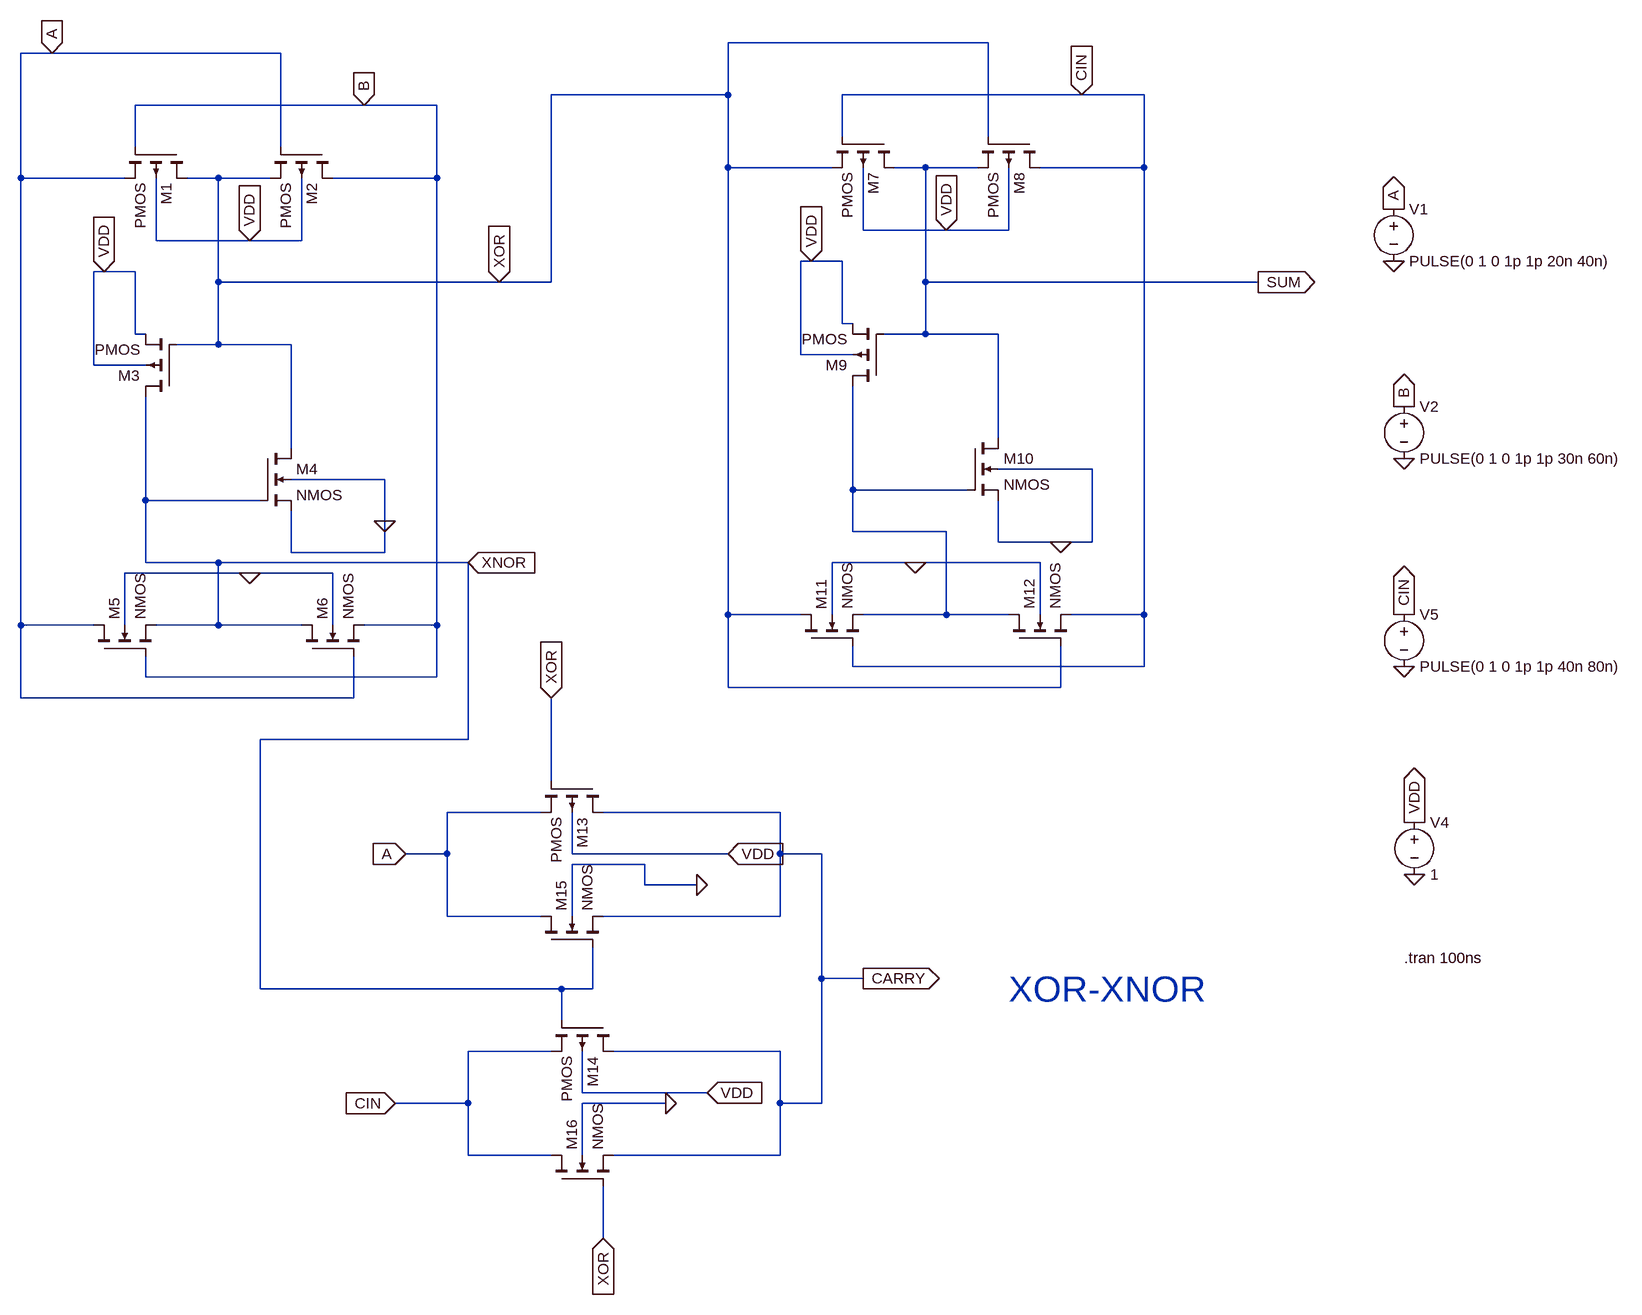
[diagram p0: schematic XOR-XNOR.asc]
XOR-XNOR.asc, the LTspice schematic file:
Version 4
SHEET 1 3128 1804
WIRE 1520 -128 1120 -128
WIRE 80 -112 32 -112
WIRE 432 -112 80 -112
WIRE 1120 -48 1120 -128
WIRE 1120 -48 848 -48
WIRE 1664 -48 1296 -48
WIRE 1760 -48 1664 -48
WIRE 560 -32 208 -32
WIRE 672 -32 560 -32
WIRE 1296 16 1296 -48
WIRE 1520 16 1520 -128
WIRE 208 32 208 -32
WIRE 432 32 432 -112
WIRE 1120 64 1120 -48
WIRE 1280 64 1120 64
WIRE 1424 64 1376 64
WIRE 1504 64 1424 64
WIRE 1760 64 1760 -48
WIRE 1760 64 1600 64
WIRE 32 80 32 -112
WIRE 192 80 32 80
WIRE 336 80 288 80
WIRE 416 80 336 80
WIRE 672 80 672 -32
WIRE 672 80 512 80
WIRE 1328 160 1328 64
WIRE 1456 160 1328 160
WIRE 1552 160 1552 64
WIRE 1552 160 1456 160
WIRE 240 176 240 80
WIRE 384 176 240 176
WIRE 464 176 464 80
WIRE 464 176 384 176
WIRE 1248 208 1232 208
WIRE 1296 208 1248 208
WIRE 160 224 144 224
WIRE 208 224 160 224
WIRE 336 240 336 80
WIRE 768 240 336 240
WIRE 848 240 848 -48
WIRE 848 240 768 240
WIRE 1424 240 1424 64
WIRE 1936 240 1424 240
WIRE 1296 304 1296 208
WIRE 1312 304 1296 304
WIRE 208 320 208 224
WIRE 224 320 208 320
WIRE 1424 320 1424 240
WIRE 1424 320 1360 320
WIRE 1536 320 1424 320
WIRE 336 336 336 240
WIRE 336 336 272 336
WIRE 448 336 336 336
WIRE 1232 352 1232 208
WIRE 1312 352 1232 352
WIRE 144 368 144 224
WIRE 224 368 144 368
WIRE 1536 480 1536 320
WIRE 448 496 448 336
WIRE 1680 528 1536 528
WIRE 592 544 448 544
WIRE 1312 560 1312 400
WIRE 1488 560 1312 560
WIRE 224 576 224 416
WIRE 400 576 224 576
WIRE 592 608 592 544
WIRE 1312 624 1312 560
WIRE 1456 624 1312 624
WIRE 1536 640 1536 576
WIRE 1632 640 1536 640
WIRE 1680 640 1680 528
WIRE 1680 640 1632 640
WIRE 448 656 448 592
WIRE 592 656 592 608
WIRE 592 656 448 656
WIRE 224 672 224 576
WIRE 336 672 224 672
WIRE 720 672 336 672
WIRE 1408 672 1280 672
WIRE 1600 672 1408 672
WIRE 384 688 192 688
WIRE 512 688 384 688
WIRE 1120 752 1120 64
WIRE 1232 752 1120 752
WIRE 1280 752 1280 672
WIRE 1456 752 1456 624
WIRE 1456 752 1328 752
WIRE 1552 752 1456 752
WIRE 1600 752 1600 672
WIRE 1760 752 1760 64
WIRE 1760 752 1648 752
WIRE 32 768 32 80
WIRE 144 768 32 768
WIRE 192 768 192 688
WIRE 336 768 336 672
WIRE 336 768 240 768
WIRE 464 768 336 768
WIRE 512 768 512 688
WIRE 672 768 672 80
WIRE 672 768 560 768
WIRE 1312 832 1312 800
WIRE 1760 832 1760 752
WIRE 1760 832 1312 832
WIRE 224 848 224 816
WIRE 672 848 672 768
WIRE 672 848 224 848
WIRE 1120 864 1120 752
WIRE 1632 864 1632 800
WIRE 1632 864 1120 864
WIRE 32 880 32 768
WIRE 544 880 544 816
WIRE 544 880 32 880
WIRE 720 944 720 672
WIRE 720 944 400 944
WIRE 848 1008 848 880
WIRE 832 1056 688 1056
WIRE 1200 1056 928 1056
WIRE 688 1120 688 1056
WIRE 688 1120 624 1120
WIRE 880 1120 880 1056
WIRE 1120 1120 880 1120
WIRE 1200 1120 1200 1056
WIRE 1264 1120 1200 1120
WIRE 992 1136 880 1136
WIRE 992 1168 992 1136
WIRE 1072 1168 992 1168
WIRE 688 1216 688 1120
WIRE 832 1216 688 1216
WIRE 880 1216 880 1136
WIRE 1200 1216 1200 1120
WIRE 1200 1216 928 1216
WIRE 1264 1312 1264 1120
WIRE 1328 1312 1264 1312
WIRE 400 1328 400 944
WIRE 864 1328 400 1328
WIRE 912 1328 912 1264
WIRE 912 1328 864 1328
WIRE 864 1376 864 1328
WIRE 848 1424 720 1424
WIRE 1200 1424 944 1424
WIRE 896 1488 896 1424
WIRE 1088 1488 896 1488
WIRE 720 1504 720 1424
WIRE 720 1504 608 1504
WIRE 1024 1504 896 1504
WIRE 1200 1504 1200 1424
WIRE 1264 1504 1264 1312
WIRE 1264 1504 1200 1504
WIRE 720 1584 720 1504
WIRE 848 1584 720 1584
WIRE 896 1584 896 1504
WIRE 1200 1584 1200 1504
WIRE 1200 1584 944 1584
WIRE 928 1712 928 1632
FLAG 560 -32 B
IOPIN 560 -32 In
FLAG 384 176 VDD
IOPIN 384 176 In
FLAG 160 224 VDD
IOPIN 160 224 In
FLAG 592 608 0
FLAG 384 688 0
FLAG 848 880 XOR
IOPIN 848 880 In
FLAG 720 672 XNOR
IOPIN 720 672 In
FLAG 624 1120 A
IOPIN 624 1120 In
FLAG 1072 1168 0
FLAG 1120 1120 VDD
IOPIN 1120 1120 In
FLAG 1088 1488 VDD
IOPIN 1088 1488 In
FLAG 1024 1504 0
FLAG 928 1712 XOR
IOPIN 928 1712 In
FLAG 1328 1312 CARRY
IOPIN 1328 1312 Out
FLAG 1664 -48 CIN
IOPIN 1664 -48 In
FLAG 1456 160 VDD
IOPIN 1456 160 In
FLAG 1936 240 SUM
IOPIN 1936 240 Out
FLAG 1248 208 VDD
IOPIN 1248 208 In
FLAG 1632 640 0
FLAG 1408 672 0
FLAG 2144 128 A
IOPIN 2144 128 Out
FLAG 2144 208 0
FLAG 2160 432 B
IOPIN 2160 432 Out
FLAG 2160 512 0
FLAG 2160 752 CIN
IOPIN 2160 752 Out
FLAG 2160 832 0
FLAG 2176 1072 VDD
IOPIN 2176 1072 Out
FLAG 2176 1152 0
FLAG 80 -112 A
IOPIN 80 -112 In
FLAG 768 240 XOR
IOPIN 768 240 In
FLAG 608 1504 CIN
IOPIN 608 1504 In
SYMBOL pmos4 288 32 R90
SYMATTR InstName M1
SYMBOL pmos4 512 32 R90
SYMATTR InstName M2
SYMBOL pmos4 272 416 R180
SYMATTR InstName M3
SYMBOL nmos4 400 496 R0
SYMATTR InstName M4
SYMBOL nmos4 144 816 R270
SYMATTR InstName M5
SYMBOL nmos4 464 816 R270
SYMATTR InstName M6
SYMBOL pmos4 1376 16 R90
SYMATTR InstName M7
SYMBOL pmos4 1600 16 R90
SYMATTR InstName M8
SYMBOL pmos4 1360 400 R180
SYMATTR InstName M9
SYMBOL nmos4 1488 480 R0
SYMATTR InstName M10
SYMBOL nmos4 1232 800 R270
SYMATTR InstName M11
SYMBOL nmos4 1552 800 R270
SYMATTR InstName M12
SYMBOL pmos4 928 1008 R90
SYMATTR InstName M13
SYMBOL pmos4 944 1376 R90
SYMATTR InstName M14
SYMBOL nmos4 832 1264 R270
SYMATTR InstName M15
SYMBOL nmos4 848 1632 R270
SYMATTR InstName M16
SYMBOL voltage 2144 112 R0
SYMATTR InstName V1
SYMATTR Value PULSE(0 1 0 1p 1p 20n 40n)
SYMBOL voltage 2160 416 R0
SYMATTR InstName V2
SYMATTR Value PULSE(0 1 0 1p 1p 30n 60n)
SYMBOL voltage 2176 1056 R0
SYMATTR InstName V4
SYMATTR Value 1
SYMBOL voltage 2160 736 R0
SYMATTR InstName V5
SYMATTR Value PULSE(0 1 0 1p 1p 40n 80n)
TEXT 2160 1280 Left 2 !.tran 100ns
TEXT 1552 1328 Left 5 ;XOR-XNOR

The netlist it stands for:
* XOR-XNOR.asc
M1 XOR B A VDD PMOS
M2 B A XOR VDD PMOS
M3 XNOR XOR VDD VDD PMOS
M4 XOR XNOR 0 0 NMOS
M5 A B XNOR 0 NMOS
M6 XNOR A B 0 NMOS
M7 SUM CIN XOR VDD PMOS
M8 CIN XOR SUM VDD PMOS
M9 N001 SUM VDD VDD PMOS
M10 SUM N001 0 0 NMOS
M11 XOR CIN N001 0 NMOS
M12 N001 XOR CIN 0 NMOS
M13 CARRY XOR A VDD PMOS
M14 CARRY XNOR CIN VDD PMOS
M15 A XNOR CARRY 0 NMOS
M16 CIN XOR CARRY 0 NMOS
V1 A 0 PULSE(0 1 0 1p 1p 20n 40n)
V2 B 0 PULSE(0 1 0 1p 1p 30n 60n)
V4 VDD 0 1
V5 CIN 0 PULSE(0 1 0 1p 1p 40n 80n)
.model NMOS NMOS
.model PMOS PMOS
.lib standard.mos
.tran 100ns
* XOR-XNOR
.backanno
.end